# EAGLE design motor (EAGLE 6.6.0)
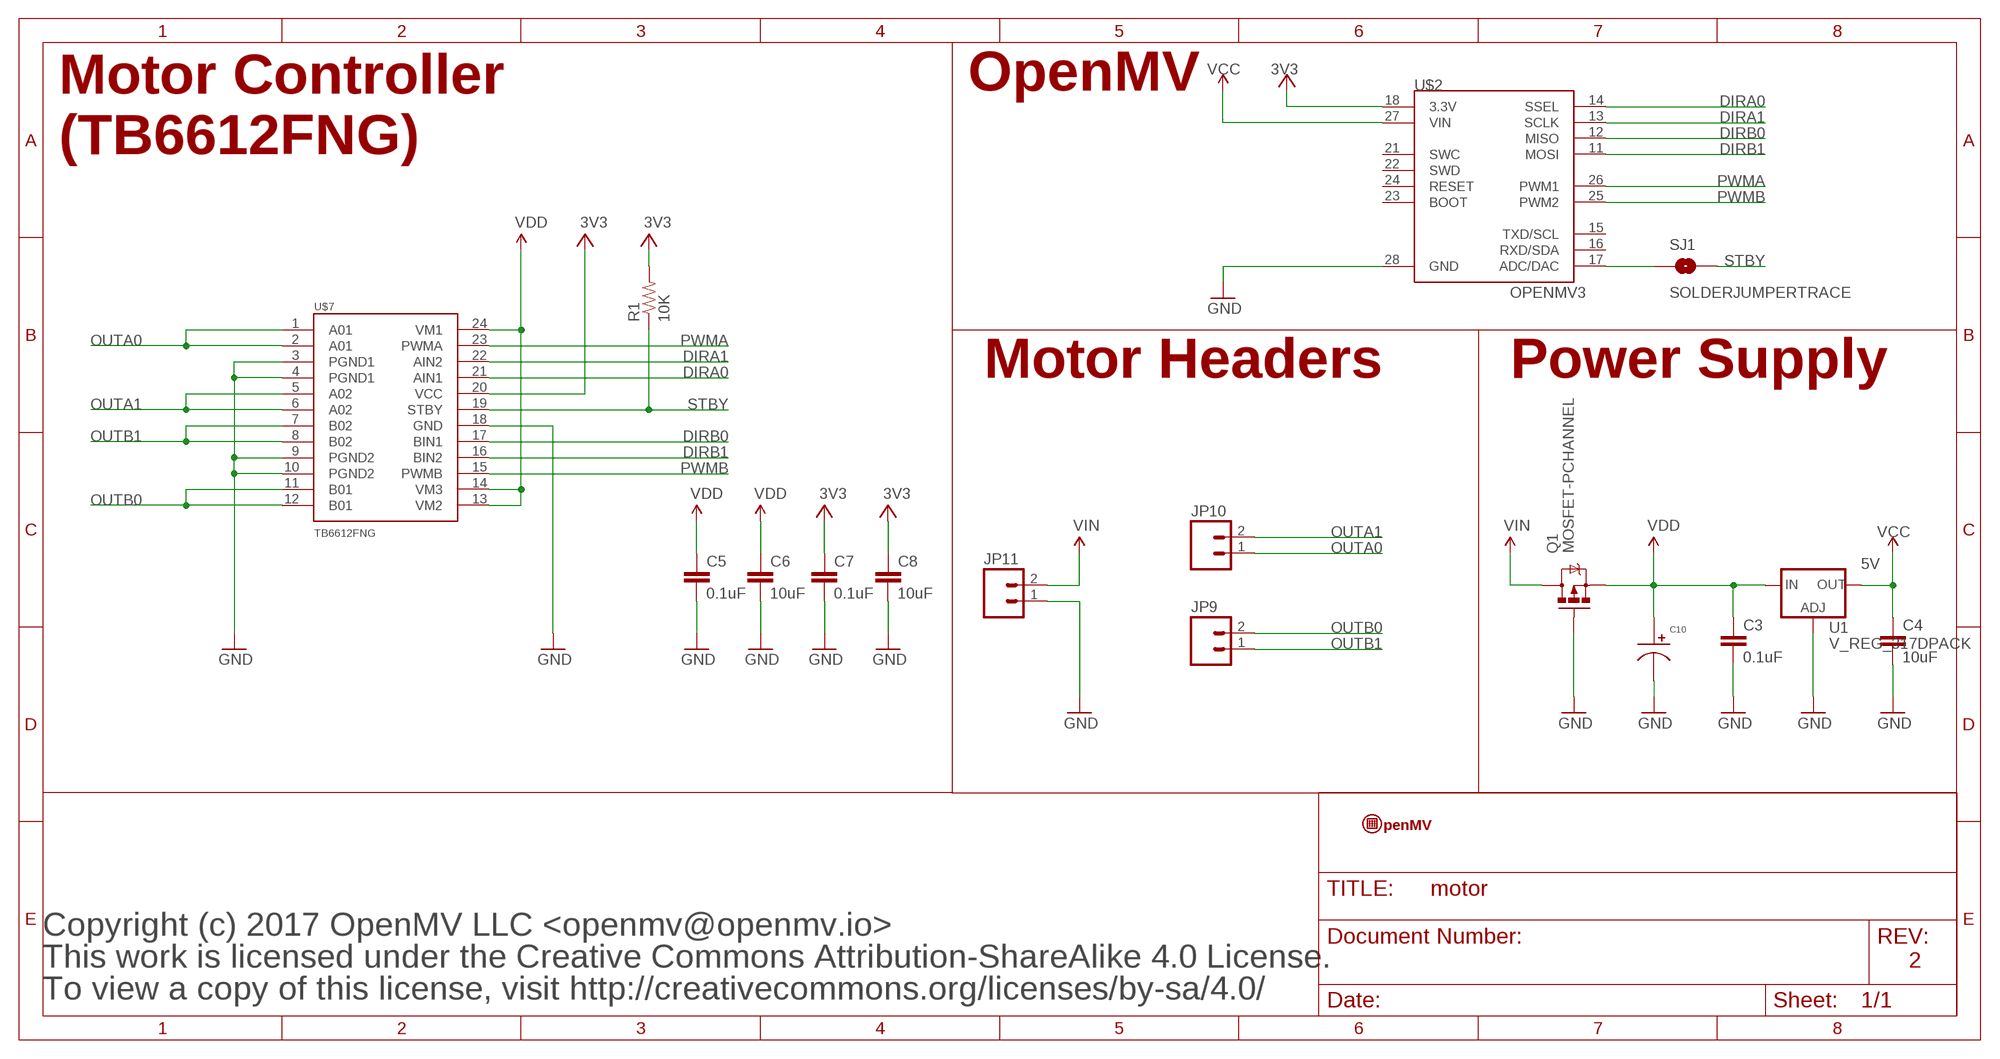
[diagram p0: schematic, sheet 1]

## Parts
C3  0.1uF  CAP0603-CAP  [0603-CAP]
C4  10uF  CAP0805  [0805]
C5  0.1uF  CAP0603-CAP  [0603-CAP]
C6  10uF  CAP0805  [0805]
C7  0.1uF  CAP0603-CAP  [0603-CAP]
C8  10uF  CAP0805  [0805]
C10  CAPACITOR_P_10MM  [CP10MM]
JP9  M023.5MM  [SCREWTERMINAL-3.5MM-2]
JP10  M023.5MM  [SCREWTERMINAL-3.5MM-2]
JP11  M023.5MM  [SCREWTERMINAL-3.5MM-2]
Q1  MOSFET-PCHANNEL  [SOT23-3]
R1  10K  10KOHM-1/10W-1%(0603)0603  [0603-RES]
SJ1  SOLDERJUMPERTRACE  [SJ_2S-TRACE]
U1  V_REG_317DPACK  [V-REG_DPACK]
U$2  OPENMV3  [OPENMV3]
U$7  TB6612FNG  [SSOP24]
U$9  OPENMV-LOGO  [OPENMV-LOGO]

## Nets
3V3: C7.1 C8.1 R1.2 U$2.18(3.3V) U$7.20(VCC)
DIRA0: U$2.14(SSEL) U$7.21(AIN1)
DIRA1: U$2.13(SCLK) U$7.22(AIN2)
DIRB0: U$2.12(MISO) U$7.17(BIN1)
DIRB1: U$2.11(MOSI) U$7.16(BIN2)
GND: C3.2 C4.2 C5.2 C6.2 C7.2 C8.2 C10.P$2 JP11.1 Q1.1(G) U1.1(ADJ) U$2.28(GND) U$7.3(PGND1) U$7.4(PGND1) U$7.9(PGND2) U$7.10(PGND2) U$7.18(GND)
OUTA0: JP10.1 U$7.1(A01) U$7.2(A01)
OUTA1: JP10.2 U$7.5(A02) U$7.6(A02)
OUTB0: JP9.2 U$7.11(B01) U$7.12(B01)
OUTB1: JP9.1 U$7.7(B02) U$7.8(B02)
PWMA: U$2.26(PWM1) U$7.23(PWMA)
PWMB: U$2.25(PWM2) U$7.15(PWMB)
STBY: R1.1 SJ1.2 U$7.19(STBY)
STBY_TRACE: SJ1.1 U$2.17(ADC/DAC)
VCC: C4.1 U1.4(OUT) U$2.27(VIN)
VDD: C3.1 C5.1 C6.1 C10.P$1 Q1.2(S) U1.3(IN) U$7.13(VM2) U$7.14(VM3) U$7.24(VM1)
VIN: JP11.2 Q1.3(D)
Unconnected: U$2.15(TXD/SCL) U$2.16(RXD/SDA) U$2.21(SWC) U$2.22(SWD) U$2.23(BOOT) U$2.24(RESET)

## Notes on the sheet
- OpenMV
- Motor Controller
  (TB6612FNG)
- Motor Headers | Power Supply
- 5V
- Copyright (c) 2017 OpenMV LLC <openmv@openmv.io>
- This work is licensed under the Creative Commons Attribution-ShareAlike 4.0 License. | 2
- To view a copy of this license, visit http://creativecommons.org/licenses/by-sa/4.0/

## Library data of the parts
C3-C8 = sfe:CAP: Capacitor Standard 0603 ceramic capacitor, and 0.1" leaded capacitor.
C10 = MF_Passives:CAPACITOR_P: Library: MF_Passives Description: Device for Polarized Capacitors. Manufacture part number (MFG#), Voltage Rating, and Tolerance can be added via Attributes.; MGF#: N/A; TOLERANCE: N/A; VOLTAGE: N/A
JP9-JP11 = SparkFun-Connectors:M02: Standard 2-pin 0.1" header. Use with - straight break away headers ( PRT-00116) - right angle break away headers (PRT-00553) - swiss pins (PRT-00743) - machine pins (PRT-00117) - female headers (PRT-00115) Molex polarized connector foot print use with: PRT-08233 with associated crimp pins and housings. 2.54_SCREWTERM for use with PRT-10571. 3.5mm Screw Terminal footprints for PRT-08084 5mm Screw Terminal footprints for use with PRT-08432; PROD_ID: CONN-08399
Q1 = SparkFun-DiscreteSemi:MOSFET-PCHANNEL: Generic PMOSFET IRLML2244 - TRANS-11153 (SOT-23 -20V -4.3A) (1.Gate 2.Source 3.Drain) FQP27P06 - COM-10349 <http://www.sparkfun.com/products/10349> (TO-220 -60V -27A) (1.Gate 2.Source 3.Drain); PROD_ID: TRANS-08285
R1 = SparkFun-Resistors:10KOHM-1/10W-1%(0603): RES-00824; PROD_ID: RES-00824
SJ1 = SparkFun-Retired:SOLDERJUMPER: Solder Jumper Standard SMD solder jumper. Used to automate production. Two varients : Normally Open and Normally Closed are the same, but have different paste layers. NC will have a large amount of paste and should jumper during reflow.
U1 = SparkFun-PowerIC:V_REG_317: Voltage Regulator Standard LM317 adjustable voltage regulator. AOI (Adjust Output Input). Google 'LM317 Calculator' for easy to use app to get the two resistor values needed. 240/720 for 5V output. 240/390 for 3.3V output. Spark Fun Electronics SKU : COM-00527; PROD_ID: IC-09888
U$2 = openmv:OPENMV3
U$7 = SparkFun-PowerIC:TB6612FNG: Toshiba 1A dual motor driver IC-09363; PROD_ID: IC-09363
U$9 = openmv:OPENMV-LOGO

## Net classes
1 vcc: width 1.016 mm, clearance 0.203 mm
2 antenna: width 0.363 mm, clearance 0.305 mm
3 1.8v: width 0.457 mm, clearance 0.254 mm

## Board
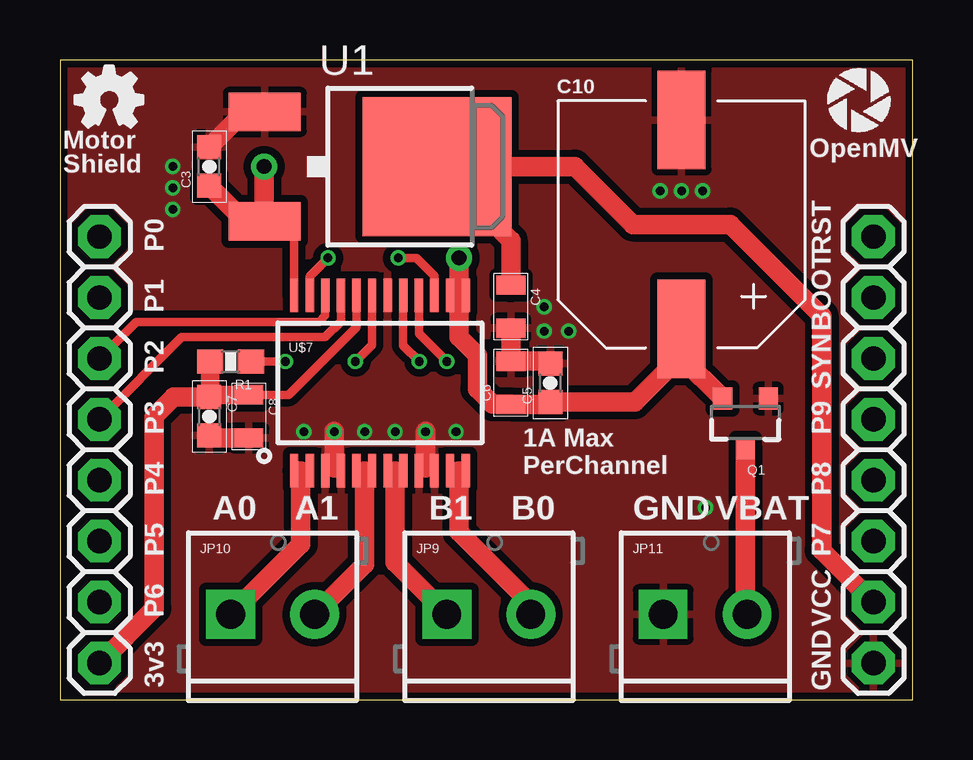
[diagram p1: board, top side]
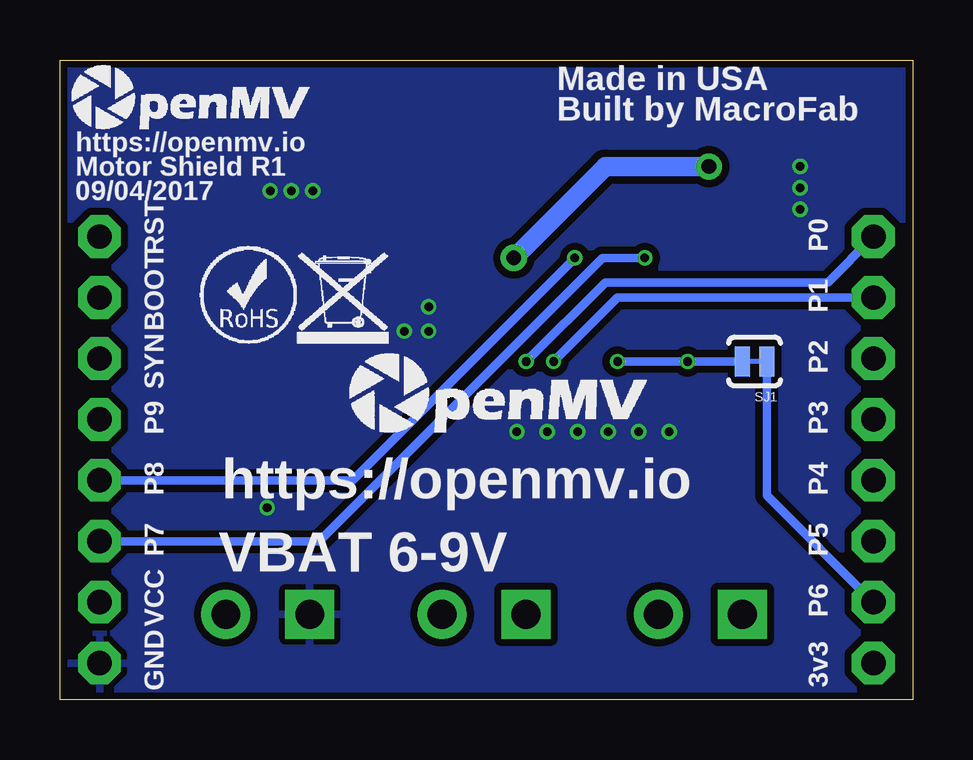
[diagram p2: board, bottom side, seen from below]

Size 35.56 x 26.67 mm. Coordinates in mm from the lower left corner, seen from the top.
Outline: 0,0 35.56,0 35.56,26.67 0,26.67 0,0
Copper layers (1*16): Top 0.035mm / dielectric 1.5mm / Bottom 0.035mm
Design rules "openmv3 *": minimum track width 5mil, minimum drill 10mil, track to track 8mil, track to pad 8mil, pad to pad 8mil, via to via 8mil, smd to smd 8mil, copper to edge 5mil, drill to drill 10mil, minimum pad ring 10mil, minimum via ring 4mil, stop-mask expansion 2mil, vias tented up to drill 30mil, thermal gap 10mil

### Footprints (pad centres in the part's own frame; a part is rotated, then mirrored left to right if it is on the bottom)
0603-CAP = smd 1 x 1: 1 -0.8,0; 2 0.8,0
0805 = smd 0.8 x 1.2: 1 -0.9,0; 2 0.9,0
CP10MM = smd 2 x 4.1: P$1 0,-4.35; P$2 0,4.35
SCREWTERMINAL-3.5MM-2 = drill 1.2 pad 2.032 square: 1 0,0 | drill 1.2 pad 2.032: 2 3.5,0
SOT23-3 = smd 0.8 x 0.9: 1 -0.95,-1; 2 0.95,-1; 3 0,1.1
0603-RES = smd 1.1 x 1: 1 -0.85,0; 2 0.85,0
SJ_2S-TRACE = smd 0.635 x 1.27: 1 -0.508,0; 2 0.508,0
V-REG_DPACK = smd 1.6 x 3: 1 -2.28,-4.8; 3 2.28,-4.8 | smd 5.8 x 6.2: 4 0,2.38
OPENMV3 = drill 1.016 pad 1.778 octagon: 11 1.651,19.304; 12 1.651,16.764; 13 1.651,14.224; 14 1.651,11.684; 15 1.651,9.144; 16 1.651,6.604; 17 1.651,4.064; 18 1.651,1.524; 21 33.909,19.304; 22 33.909,16.764; 23 33.909,14.224; 24 33.909,11.684; 25 33.909,9.144; 26 33.909,6.604; 27 33.909,4.064; 28 33.909,1.524
SSOP24 = smd 0.348 x 1.397: 1 -3.575,-3.656; 2 -2.925,-3.656; 3 -2.275,-3.656; 4 -1.625,-3.656; 5 -0.975,-3.656; 6 -0.325,-3.656; 7 0.325,-3.656; 8 0.975,-3.656; 9 1.625,-3.656; 10 2.275,-3.656; 11 2.925,-3.656; 12 3.575,-3.656; 13 3.575,3.656; 14 2.925,3.656; 15 2.275,3.656; 16 1.625,3.656; 17 0.975,3.656; 18 0.325,3.656; 19 -0.325,3.656; 20 -0.975,3.656; 21 -1.625,3.656; 22 -2.275,3.656; 23 -2.925,3.656; 24 -3.575,3.656

### Placement (x,y rotation side)
C3  6.22,22.23 90 top
C4  18.8,16.38 270 top
C5  20.45,13.21 90 top
C6  18.8,13.21 90 top
C7  6.22,11.81 270 top
C8  7.87,11.81 270 top
C10  25.91,19.81 0 top
JP9  16.13,3.56 0 top
JP10  7.11,3.56 0 top
JP11  25.15,3.56 0 top
Q1  28.57,11.56 180 top
R1  7.11,14.1 180 top
SJ1  6.6,14.1 180 bottom
U1  13.34,22.23 270 top
U$2  0,0 0 top
U$3  [OMV-LOGO]  23.62,10.92 0 bottom
U$5  [ROHS]  29.72,14.86 0 bottom
U$6  [WEEE]  25.65,14.86 0 bottom
U$7  13.34,13.21 0 top
U$9  31.88,23.5 0 top
U$10  [OMV-LOGO-SMALL]  35.18,23.62 0 bottom
U$11  [OSHW_FILLX100_NOTEXT]  0.64,23.88 0 top

### Tracks (layer width: path | path; a pad name or v marks a point on that pad's centre or on a via)
3V3
  Top 0.356: C8.1 9.54,12.71 12.36,15.54 U$7.20
  Top 0.762: C8.1 6.22,12.71 C7.1 6.26,12.61 R1.2
  Top 0.813: U$2.18 3.94,3.81 3.94,11.81 4.74,12.61 C7.1
DIRA0
  Top 0.356: U$7.21 11.71,15.77 11.05,15.11 5.08,15.11 U$2.14
DIRA1
  Top 0.356: U$7.22 11.06,16.01 10.79,15.75 3.17,15.75 U$2.13
DIRB0  (via drill 0.36)
  Top 0.356: U$7.17 14.31,14.77 v14.99,14.1
  Bottom 0.356: v14.99,14.1 12.32,16.76 U$2.12
DIRB1  (via drill 0.36)
  Top 0.356: U$7.16 14.96,15.27 v16.13,14.1
  Bottom 0.356: U$2.11 3.56,17.4 12.83,17.4 v16.13,14.1
GND  (via drill 0.36)
  Top 0.356: U$7.10 U$7.9 15.24,9.55 15.24,9.65 | U$7.3 U$7.4 11.43,9.55 11.43,9.65
  Top 0.813: C3.2 7.7,24.5 U1.1 | C7.2 6.32,10.91 C8.2 | C4.2 C6.2 20.35,14.11 C5.2 | 11.43,9.65 v11.43,11.18 | 15.24,9.65 v15.24,11.18
  other vias: 10.16,11.18 12.7,11.18 13.97,11.18 16.51,11.18 26.92,8 25.91,21.21 25.02,21.21 26.8,21.21 20.19,15.37 20.19,16.38 21.21,15.37 4.7,22.23 4.7,21.34 4.7,20.45
  pour Bottom (isolate 0.305): 0,0 35.56,0 35.56,26.67 0,26.67
  pour Top (isolate 0.305): 0,0 35.56,0 35.56,26.67 0,26.67
OUTA0
  Top 0.356: U$7.1 U$7.2 10.03,9.55 10.03,9.53
  Top 0.813: 10.03,9.53 10.03,6.48 JP10.1
OUTA1
  Top 0.356: U$7.6 U$7.5 12.7,9.55 12.7,9.53
  Top 0.813: 12.7,9.53 12.7,5.64 JP10.2
OUTB0
  Top 0.356: U$7.11 U$7.12 16.64,9.55 16.64,9.53
  Top 0.813: 16.64,9.53 16.64,6.99 19.63,3.99 JP9.2
OUTB1
  Top 0.356: U$7.7 U$7.8 13.97,9.55 13.97,9.53
  Top 0.813: 13.97,9.53 13.97,5.71 JP9.1
PWMA  (via drill 0.36)
  Top 0.356: U$7.23 10.41,17.65 v11.18,18.41
  Bottom 0.356: v11.18,18.41 12.95,18.41 24.77,6.6 U$2.26
PWMB  (via drill 0.36)
  Top 0.356: v14.1,18.41 14.86,18.41 15.61,17.66 U$7.15
  Bottom 0.356: U$2.25 23.37,9.14 v14.1,18.41
STBY  (via drill 0.36)
  Top 0.356: R1.1 v9.4,14.1 | v12.32,14.1 13.01,14.79 U$7.19
  Bottom 0.356: v12.32,14.1 v9.4,14.1 SJ1.2
STBY_TRACE
  Bottom 0.356: U$2.17 6.1,8.51 SJ1.1
VCC
  Top 0.813: U$2.27 31.75,6.22 31.75,16 27.94,19.81 23.88,19.81 21.46,22.23 U1.4 18.8,19.14 C4.1
VDD  (via drill 0.61)
  Top 0.356: U$7.24 9.76,19.95 U1.3 | 16.64,16.86 U$7.13 U$7.14 16.64,16.86 | 16.64,16.86 16.64,16.76 | 16.64,16.86 16.64,16.89
  Top 0.813: 16.64,16.76 16.64,15.11 17.4,14.35 17.4,12.95 18.03,12.32 18.79,12.32 C6.1 20.35,12.31 C5.1 23.96,12.41 25.91,14.35 C10.P$1 25.91,14.27 Q1.2 | 16.64,16.89 v16.64,18.41 | v8.51,22.23 8.51,19.95 | 8.51,19.95 U1.3 | 8.51,19.95 7.7,19.95 C3.1
  Bottom 0.813: v16.64,18.41 12.83,22.23 v8.51,22.23
VIN
  Top 0.813: Q1.3 28.57,3.63 JP11.2

### Text on the board
tPlace: OpenMV | Motor / Shield | P0 | RST | P1 | BOOT | P2 | SYN | P3 | P9 | P4 | 1A Max / PerChannel | P8 | A0 | A1 | B1 | B0 | GND | VBAT | P5 | P7 | P6 | VCC | 3v3 | GND
bPlace: Made in USA | Built by MacroFab | https://openmv.io | Motor Shield R1 | 09/04/2017 | P0 | RST | P1 | BOOT | P2 | SYN | P3 | P9 | P4 | P8 | https://openmv.io | P5 | P7 | VBAT 6-9V | P6 | VCC | 3v3 | GND